# EAGLE design source_eagle (EAGLE 9.6.2)
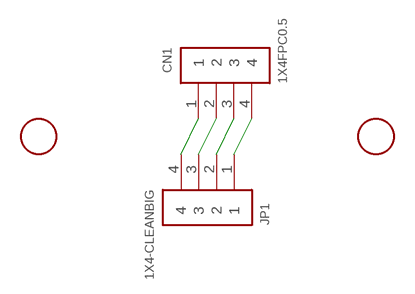
[diagram p0: schematic, sheet 1]

## Parts
CN1  1X4FPC0.5  [FPC_0.5MM-4]
JP1  1X4-CLEANBIG  [1X04-CLEANBIG]
U$2  FIDUCIAL  [FIDUCIAL_1MM]
U$3  FIDUCIAL  [FIDUCIAL_1MM]

## Nets
N$1: CN1.4 JP1.1
N$2: CN1.3 JP1.2
N$3: CN1.2 JP1.3
N$4: CN1.1 JP1.4

## Library data of the parts
CN1 JP1 = adafruit:1X4: 4-pin connector
U$2 U$3 = adafruit:FIDUCIAL: For use by pick and place machines to calibrate the vision/machine, 1mm By microbuilder.eu

## Board
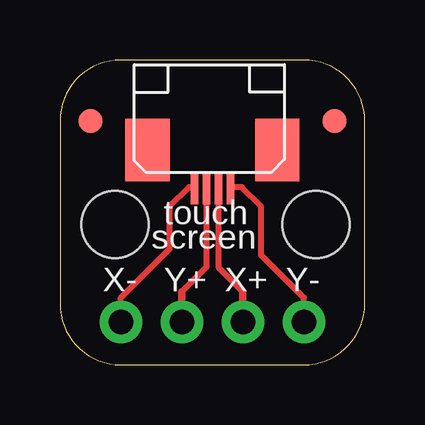
[diagram p1: board, top side]
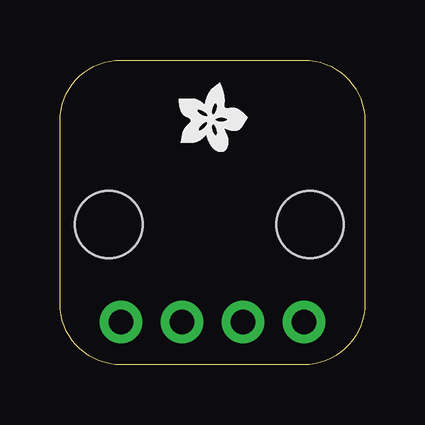
[diagram p2: board, bottom side, seen from below]

Size 12.7 x 12.7 mm. Coordinates in mm from the lower left corner, seen from the top.
Outline: 2.54,12.7 arc90 0,10.16 0,2.54 arc90 2.54,0 10.16,0 arc90 12.7,2.54 12.7,10.16 arc90 10.16,12.7 2.54,12.7
Copper layers (1*16): Top 0.035mm / dielectric 1.5mm / Bottom 0.035mm
Design rules "default": minimum track width 10mil, minimum drill 24mil, track to track 8mil, track to pad 8mil, pad to pad 8mil, via to via 8mil, smd to smd 8mil, copper to edge 40mil, drill to drill 8mil, minimum pad ring 10mil, minimum via ring 8mil, stop-mask expansion 4mil, vias tented up to drill 0mil, thermal gap 10mil
Holes 2.8 mm at 2.29,5.84 10.67,5.84

### Footprints (pad centres in the part's own frame; a part is rotated, then mirrored left to right if it is on the bottom)
FPC_0.5MM-4 = smd 0.3 x 1.25: 1 -0.75,-0.45; 2 -0.25,-0.45; 3 0.25,-0.45; 4 0.75,-0.45 | smd 1.85 x 2.6: MT -2.7,-2.1; MT2 2.7,-2.1
1X04-CLEANBIG = drill 1.016 pad 1.778: 1 -3.81,0; 2 -1.27,0; 3 1.27,0; 4 3.81,0
FIDUCIAL_1MM = smd 1 x 1: 1 0,0

### Placement (x,y rotation side)
CN1  6.35,6.86 180 top
JP1  6.35,1.78 0 top
U$1  [ADAFRUIT200MIL]  6.35,10.41 270 bottom
U$2  1.27,10.16 0 top
U$3  11.43,10.16 0 top

### Tracks (layer width: path | path; a pad name or v marks a point on that pad's centre or on a via)
N$1
  Top 0.254: JP1.1 2.54,2.79 4.57,4.83 4.57,6.6 5.38,7.41 5.59,7.41 5.59,7.31 CN1.4
N$2
  Top 0.254: CN1.3 6.1,4.07 5.08,3.05
  Top 0.305: JP1.2 5.08,3.05
N$3
  Top 0.254: CN1.2 6.6,4.07 7.62,3.05
  Top 0.305: JP1.3 7.62,3.05
N$4
  Top 0.254: JP1.4 10.16,2.79 8.38,4.57 8.38,6.6 7.58,7.41 7.11,7.41 7.11,7.31 CN1.1

### Text on the board
tPlace: touch | screen | X- | Y+ | X+ | Y-